# EAGLE design LCD-Shield V2 (EAGLE 9.5.2)
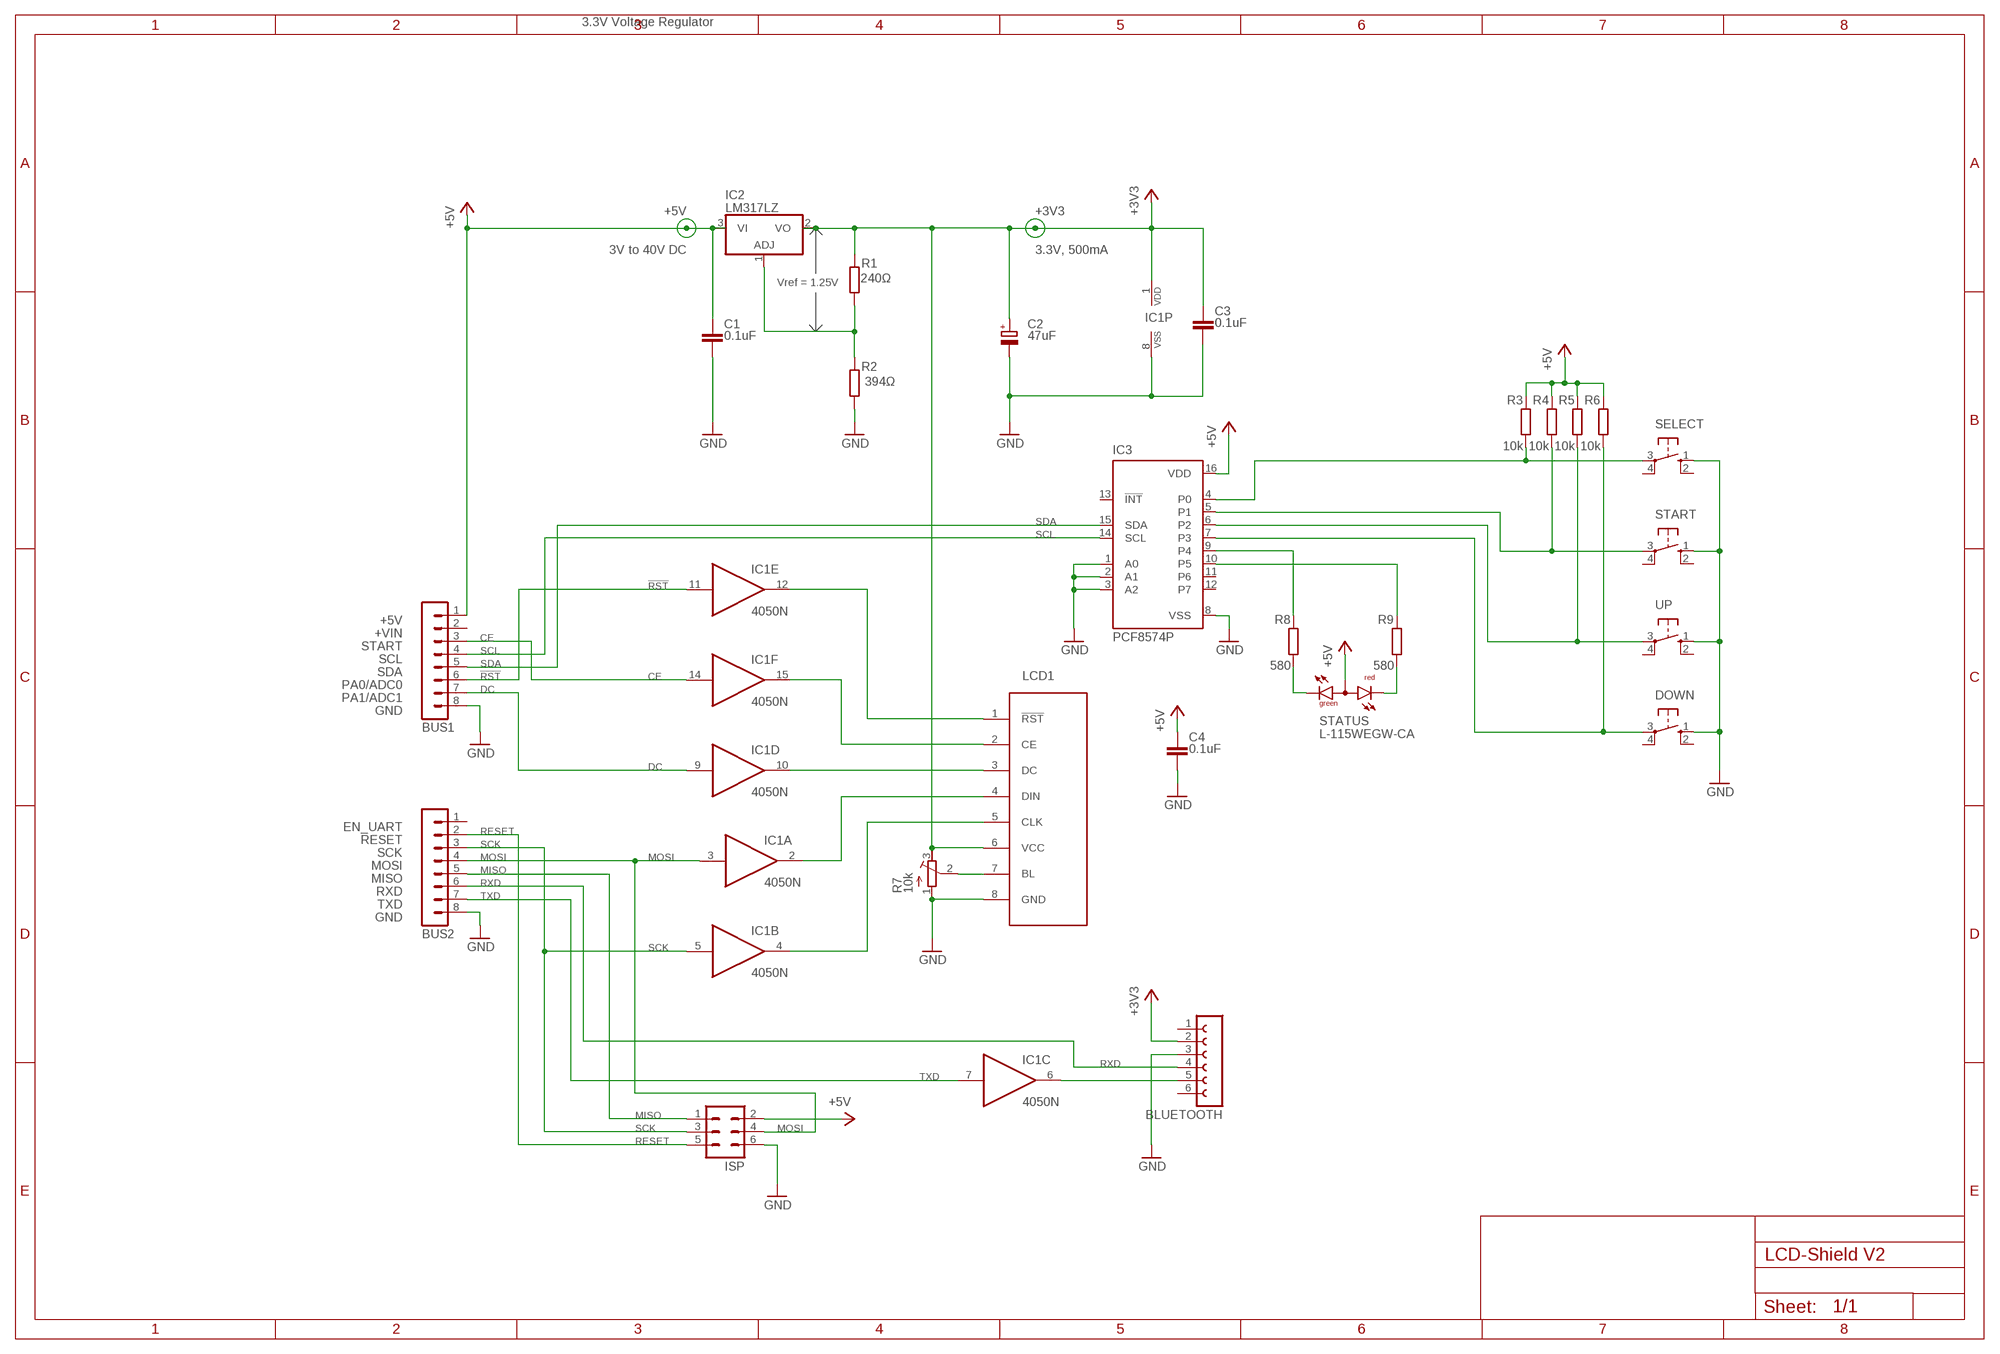
[diagram p0: schematic, sheet 1]

## Parts
BLUETOOTH  FE06-1  [FE06]
BUS1  MA08-1  [MA08-1]
BUS2  MA08-1  [MA08-1]
C1  0.1uF  C-EU025-024X044  [C025-024X044]
C2  47uF  CPOL-EUE2-4  [E2-4]
C3  0.1uF  C-EU025-024X044  [C025-024X044]
C4  0.1uF  C-EU025-024X044  [C025-024X044]
DOWN  10-XX  [B3F-10XX]
IC1  4050N  [DIL16]
IC2  LM317LZ  [TO92]
IC3  PCF8574P  [DIL16]
ISP  MA03-2  [MA03-2]
LCD1  5110_LCD_NOKIA  [LCD_5110]
R1  240Ω  R-EU_0207/7  [0207/7]
R2  394Ω  R-EU_0207/7  [0207/7]
R3  10k  R-EU_0207/7  [0207/7]
R4  10k  R-EU_0207/7  [0207/7]
R5  10k  R-EU_0207/7  [0207/7]
R6  10k  R-EU_0207/7  [0207/7]
R7  10k  R-TRIMM3296W  [RTRIM3296W]
R8  580  R-EU_0207/7  [0207/7]
R9  580  R-EU_0207/7  [0207/7]
SELECT  10-XX  [B3F-10XX]
START  10-XX  [B3F-10XX]
STATUS  L-115WEGW-CA  [DUOLED-A-3MM]
UP  10-XX  [B3F-10XX]

## Nets
!RST: BUS1.6 IC1.11(E:I)
+3V3: BLUETOOTH.2 C2.+ C3.1 IC1.1(P:VDD) IC2.2(VO) LCD1.6(VCC) R1.2 R7.3(E)
+5V: BUS1.1 C1.1 C4.1 IC2.3(VI) IC3.16(VDD) ISP.2 R3.2 R4.2 R5.2 R6.2 STATUS.2(A)
CE: BUS1.3 IC1.14(F:I)
DC: BUS1.7 IC1.9(D:I)
GND: BLUETOOTH.3 BUS1.8 BUS2.8 C1.2 C2.- C3.2 C4.2 DOWN.1(S) IC1.8(P:VSS) IC3.1(A0) IC3.2(A1) IC3.3(A2) IC3.8(VSS) ISP.6 LCD1.8(GND) R2.1 R7.1(A) SELECT.1(S) START.1(S) UP.1(S)
MISO: BUS2.5 ISP.1
MOSI: BUS2.4 IC1.3(A:I) ISP.4
N$1: IC1.12(E:O) LCD1.1(!RST)
N$2: IC1.15(F:O) LCD1.2(CE)
N$3: IC1.10(D:O) LCD1.3(DC)
N$4: IC1.2(A:O) LCD1.4(DIN)
N$5: IC1.4(B:O) LCD1.5(CLK)
N$6: IC2.1(ADJ) R1.1 R2.2
N$7: R8.1 STATUS.1(CG)
N$8: LCD1.7(BL) R7.2(S)
N$9: R9.1 STATUS.3(CR)
N$10: IC3.9(P4) R8.2
N$11: IC3.10(P5) R9.2
N$17: IC3.4(P0) R3.1 SELECT.3(P)
N$18: IC3.5(P1) R4.1 START.3(P)
N$19: IC3.6(P2) R5.1 UP.3(P)
N$20: DOWN.3(P) IC3.7(P3) R6.1
N$22: BLUETOOTH.5 IC1.6(C:O)
RESET: BUS2.2 ISP.5
RXD: BLUETOOTH.4 BUS2.6
SCK: BUS2.3 IC1.5(B:I) ISP.3
SCL: BUS1.4 IC3.14(SCL)
SDA: BUS1.5 IC3.15(SDA)
TXD: BUS2.7 IC1.7(C:I)
Unconnected: BLUETOOTH.1 BLUETOOTH.6 BUS1.2 BUS2.1 DOWN.2(S1) DOWN.4(P1) IC3.11(P6) IC3.12(P7) IC3.13(!INT) SELECT.2(S1) SELECT.4(P1) START.2(S1) START.4(P1) UP.2(S1) UP.4(P1)

## Notes on the sheet
- 3.3V Voltage Regulator
- 3V to 40V DC | 3.3V, 500mA
- Vref = 1.25V
- +5V
- +VIN
- START
- SCL
- SDA
- PA0/ADC0
- PA1/ADC1
- GND
- EN_UART
- RESET
- SCK
- MOSI
- MISO
- RXD
- TXD
- GND

## Library data of the parts
BLUETOOTH = con-lsta:FE06-1: FEMALE HEADER; OC_FARNELL: unknown; OC_NEWARK: unknown
BUS1 BUS2 = con-lstb:MA08-1: PIN HEADER; OC_FARNELL: unknown; OC_NEWARK: unknown
C1 C3 C4 = rcl:C-EU: CAPACITOR, European symbol
C2 = rcl:CPOL-EU: POLARIZED CAPACITOR, European symbol
DOWN SELECT START UP = switch-omron:10-XX: OMRON SWITCH; MPN: B3F-1000; OC_FARNELL: 176432; OC_NEWARK: 36M3542
IC1 = 40xx:4050: Hex non-inverting BUFFER
IC2 = linear:*317: Positive VOLTAGE REGULATOR
IC3 = micro-philips:PCF8574: I2C-Bus Remote 8-bit I/O expander http://www.semiconductors.philips.com/acrobat_download/datasheets/PCF8574_4.pdf; MPN: PCF8574PN; OC_FARNELL: 204020; OC_NEWARK: 11N8515
ISP = con-lstb:MA03-2: PIN HEADER; OC_FARNELL: unknown; OC_NEWARK: unknown
LCD1 = 5110_LCD:5110_LCD_NOKIA
R1-R6 R8 R9 = rcl:R-EU_: RESISTOR, European symbol
R7 = rcl:R-TRIMM: Trimm resistor; SPICEMODEL: X; SPICEPREFIXL: POT
STATUS = led:L-115WEGW-CA: T-1(3mm) BI-COLOR INDICATOR LAMP Source: Kingbright .. 2_colour_led_.pdf

## Board
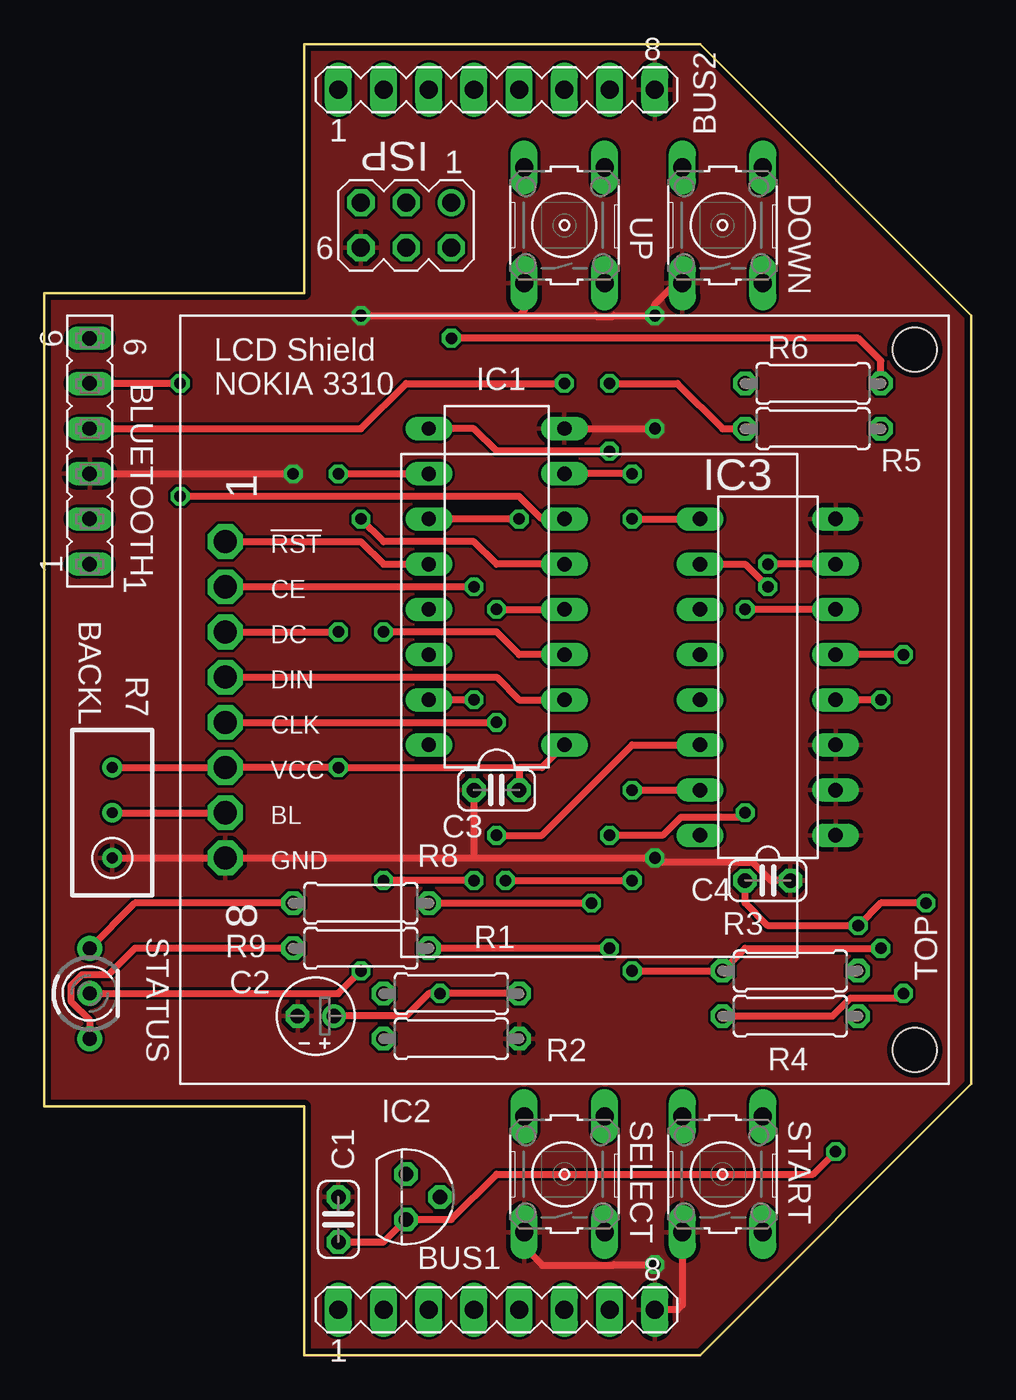
[diagram p1: board, top side]
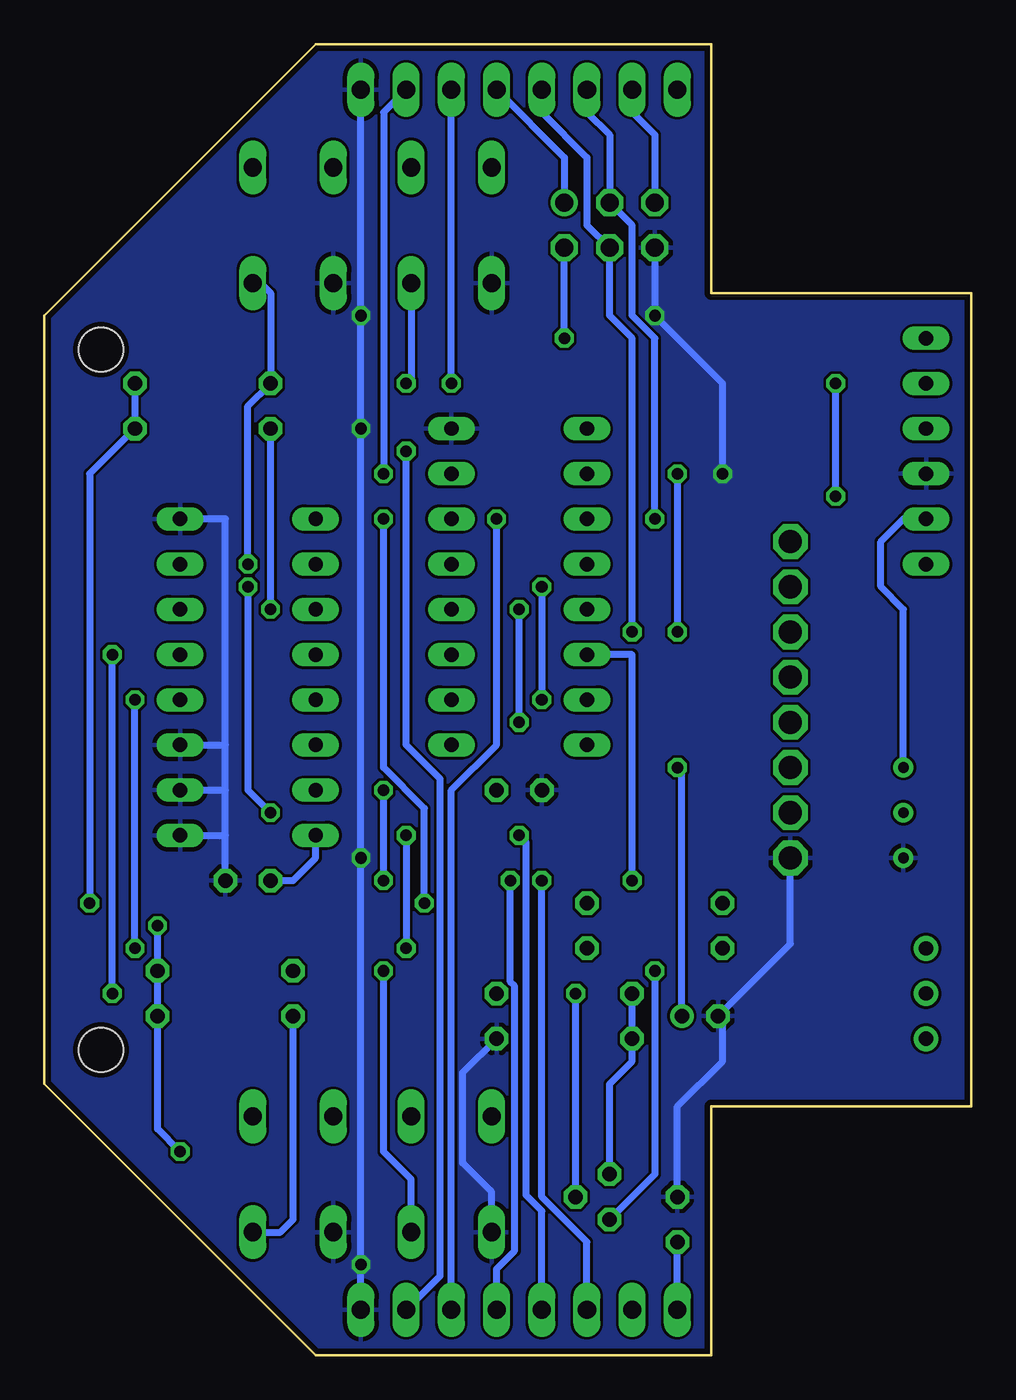
[diagram p2: board, bottom side, seen from below]

Size 52.07 x 73.66 mm. Coordinates in mm from the lower left corner, seen from the top.
Outline: 36.83,73.66 36.83,73.66
Outline: 36.83,73.66 14.61,73.66 14.61,59.69 0,59.69 0,13.97 14.61,13.97 14.61,0 36.83,0 52.07,15.24 52.07,58.42 36.83,73.66
Copper layers (1*16): Top 0.035mm / dielectric 1.5mm / Bottom 0.035mm
Design rules "default *": minimum track width 6mil, minimum drill 0.35mm, track to track 6mil, track to pad 6mil, pad to pad 6mil, via to via 6mil, smd to smd 6mil, copper to edge 0.3mm, drill to drill 6mil, minimum pad ring 10mil, minimum via ring 8mil, stop-mask expansion 4mil, vias tented up to drill 0mil, thermal gap 10mil

### Footprints (pad centres in the part's own frame; a part is rotated, then mirrored left to right if it is on the bottom)
FE06 = drill 0.813 long: 1 -6.35,0; 2 -3.81,0; 3 -1.27,0; 4 1.27,0; 5 3.81,0; 6 6.35,0
MA08-1 = drill 1.016 long: 1 -8.89,0; 2 -6.35,0; 3 -3.81,0; 4 -1.27,0; 5 1.27,0; 6 3.81,0; 7 6.35,0; 8 8.89,0
C025-024X044 = drill 0.813 octagon: 1 -1.27,0; 2 1.27,0
E2-4 = drill 0.813 pad 1.27: + -1.016,0 | drill 0.813 pad 1.27 octagon: - 1.016,0
B3F-10XX = drill 1.016 long: 1 -3.251,2.261; 2 3.251,2.261; 3 -3.251,-2.261; 4 3.251,-2.261
DIL16 = drill 0.813 long: 1 -8.89,-3.81; 2 -6.35,-3.81; 3 -3.81,-3.81; 4 -1.27,-3.81; 5 1.27,-3.81; 6 3.81,-3.81; 7 6.35,-3.81; 8 8.89,-3.81; 9 8.89,3.81; 10 6.35,3.81; 11 3.81,3.81; 12 1.27,3.81; 13 -1.27,3.81; 14 -3.81,3.81; 15 -6.35,3.81; 16 -8.89,3.81
TO92 = drill 0.813 octagon: 1 -1.27,0; 2 0,1.905; 3 1.27,0
MA03-2 = drill 1.016: 1 -2.54,-1.27 | drill 1.016 octagon: 2 -2.54,1.27; 3 0,-1.27; 4 0,1.27; 5 2.54,-1.27; 6 2.54,1.27
LCD_5110 = drill 1.3 octagon: 1 12.7,2.54; 2 15.24,2.54; 3 17.78,2.54; 4 20.32,2.54; 5 22.86,2.54; 6 25.4,2.54; 7 27.94,2.54; 8 30.48,2.54 | hole 2.5: 1.905,41.275; 41.275,41.275
0207/7 = drill 0.813 octagon: 1 -3.81,0; 2 3.81,0
RTRIM3296W = drill 0.61: 1 0,-2.54; 2 0,0; 3 0,2.54
DUOLED-A-3MM = drill 0.8 pad 1.4: 1 -2.54,0; 2 0,0; 3 2.54,0

### Placement (x,y rotation side)
BLUETOOTH  2.54,50.8 90 top
BUS1  25.4,2.54 0 top
BUS2  25.4,71.12 0 top
C1  16.51,7.62 90 top
C2  15.24,19.05 180 top
C3  25.4,31.75 180 top
C4  40.64,26.67 0 top
DOWN  38.1,63.5 90 top
IC1  25.4,43.18 90 top
IC2  20.32,8.89 270 top
IC3  40.64,38.1 90 top
ISP  20.32,63.5 180 top
LCD1  7.62,58.42 270 top
R1  22.86,20.32 0 top
R2  22.86,17.78 180 top
R3  41.91,21.59 0 top
R4  41.91,19.05 0 top
R5  43.18,52.07 0 top
R6  43.18,54.61 0 top
R7  3.81,30.48 0 top
R8  17.78,25.4 0 top
R9  17.78,22.86 0 top
SELECT  29.21,10.16 90 top
START  38.1,10.16 90 top
STATUS  2.54,20.32 270 top
UP  29.21,63.5 90 top

### Tracks (layer width: path | path; a pad name or v marks a point on that pad's centre or on a via)
!RST  (via drill 0.65)
  Top 0.406: v26.67,46.99 IC1.11
  Bottom 0.406: BUS1.6 29.21,31.75 26.67,34.29 v26.67,46.99
+3V3  (via drill 0.65)
  Top 0.406: R1.2 v22.23,20.32 21.59,20.32 20.32,19.05 C2.+ | 26.67,33.02 v16.51,33.02 LCD1.6 R7.3 | 26.67,33.02 C3.1 | IC1.1 27.94,33.02 26.67,33.02
  Bottom 0.406: C2.+ 16.26,32.77 v16.51,33.02 | IC2.2 v22.23,20.32 | R7.3 3.81,41.91 5.08,43.18 5.08,45.72 3.81,46.99 BLUETOOTH.2
+5V  (via drill 0.65)
  Top 0.406: C1.1 19.05,6.35 IC2.3 22.86,7.62 25.4,10.16 43.18,10.16 v44.45,11.43 | C4.1 39.37,25.4 40.64,24.13 v45.72,24.13 46.99,25.4 v49.53,25.4 | R6.2 46.99,55.88 45.72,57.15 v22.86,57.15 | STATUS.2 16.51,20.32 v17.78,21.59
  Bottom 0.406: BUS1.1 C1.1 | v44.45,11.43 45.72,12.7 R4.2 R3.2 v45.72,24.13 | C4.1 38.1,26.67 36.83,27.94 IC3.16 | R6.2 R5.2 49.53,49.53 v49.53,25.4 | v22.86,57.15 ISP.2 | v17.78,21.59 17.78,10.16 IC2.3
CE  (via drill 0.65)
  Top 0.406: v24.13,26.67 v19.05,26.67
  Bottom 0.406: BUS1.3 21.59,6.35 24.13,8.89 v24.13,26.67 | v19.05,26.67 19.05,39.37 IC1.14
DC  (via drill 0.65)
  Top 0.406: v31.75,50.8 25.4,50.8 24.13,52.07 IC1.9
  Bottom 0.406: BUS1.7 29.84,4.45 29.84,32.38 31.75,34.29 v31.75,50.8
GND  (via drill 0.65)
  Top 0.406: R7.1 LCD1.8 24.13,27.94 | 24.13,27.94 v34.29,27.94 34.54,27.69 39.79,27.69 40.81,26.67 C4.2 | C3.2 24.13,27.94 | IC1.8 v34.29,52.07 | v17.78,58.42 26.67,58.42 | 26.67,58.42 30.96,58.42 31.01,58.37 31.93,58.37 31.98,58.42 v34.29,58.42 34.29,59.05 35.56,60.33 35.76,60.33 DOWN.1 | UP.1 26.95,58.7 26.67,58.42 | BLUETOOTH.3 v13.97,49.53 | SELECT.1 26.95,6.07 27.99,5.03 31.93,5.03 31.98,5.08 v34.29,5.08 | START.1 35.84,2.82 35.56,2.54 BUS1.8
  Bottom 0.406: C1.2 16.51,13.97 13.97,16.51 13.97,18.8 C2.- 10.16,23.11 LCD1.8 | BUS1.8 v34.29,5.08 v34.29,27.94 v34.29,52.07 v34.29,58.42 BUS2.8 | C4.2 41.91,29.21 | 41.91,29.21 41.91,31.75 | 41.91,31.75 41.91,34.29 | 41.91,34.29 41.91,46.99 IC3.8 | IC3.1 41.91,29.21 | ISP.6 v17.78,58.42 13.97,54.61 v13.97,49.53 | IC3.3 41.91,34.29 | IC3.2 41.91,31.75 | R2.1 28.57,15.88 28.57,10.79 26.95,9.17 SELECT.1
  pour Bottom: -1.27,60.96 13.97,60.96 13.97,74.93 36.83,74.93 53.34,58.42 53.34,15.24 36.83,-1.27 13.97,-1.27 13.97,12.7 -1.27,12.7
  pour Top: -1.27,60.96 13.97,60.96 13.97,74.93 36.83,74.93 53.34,58.42 53.34,15.24 36.83,-1.27 13.97,-1.27 13.97,12.7 -1.27,12.7
MISO
  Bottom 0.406: BUS2.5 22.86,67.31 ISP.1
MOSI  (via drill 0.65)
  Top 0.406: IC1.3 26.67,39.37 25.4,40.64 v19.05,40.64
  Bottom 0.406: BUS2.4 24.13,69.85 21.59,67.31 21.59,63.5 ISP.4 20.32,58.42 19.05,57.15 v19.05,40.64
N$1
  Top 0.406: LCD1.1 17.78,45.72 19.05,44.45 IC1.12
N$2  (via drill 0.65)
  Top 0.406: LCD1.2 v24.13,43.18 | v24.13,36.83 IC1.15
  Bottom 0.406: v24.13,43.18 v24.13,36.83
N$3  (via drill 0.65)
  Top 0.406: LCD1.3 v16.51,40.64 | v16.51,49.53 IC1.10
  Bottom 0.406: v16.51,49.53 v16.51,40.64
N$4
  Top 0.406: LCD1.4 25.4,38.1 26.67,36.83 IC1.2
N$5  (via drill 0.65)
  Top 0.406: LCD1.5 v25.4,35.56 | v25.4,41.91 IC1.4
  Bottom 0.406: v25.4,35.56 v25.4,41.91
N$6
  Bottom 0.406: IC2.1 20.32,15.24 19.05,16.51 R2.2 R1.1
N$7
  Top 0.406: R8.1 5.08,25.4 STATUS.1
N$8
  Top 0.406: R7.2 LCD1.7
N$9
  Top 0.406: STATUS.3 2.54,18.83 1.48,19.88 1.48,20.76 2.1,21.38 3.6,21.38 5.08,22.86 R9.1
N$10  (via drill 0.65)
  Top 0.406: R8.2 v30.73,25.4 | v33.02,46.99 IC3.9
  Bottom 0.406: v30.73,25.4 30.73,30.73 33.02,33.02 v33.02,46.99
N$11  (via drill 0.65)
  Top 0.406: IC3.10 39.37,44.45 v40.64,43.18 | v39.37,30.48 39.12,30.23 35.75,30.23 34.73,29.21 v31.75,29.21 | v31.75,22.86 R9.2
  Bottom 0.406: v40.64,43.18 40.64,31.75 v39.37,30.48 | v31.75,29.21 v31.75,22.86
N$17  (via drill 0.65)
  Top 0.406: v33.02,21.59 R3.1 39.37,22.86 v46.99,22.86 | v46.99,36.83 IC3.4
  Bottom 0.406: SELECT.3 31.47,9.88 33.02,11.43 v33.02,21.59 | v46.99,22.86 v46.99,36.83
N$18  (via drill 0.65)
  Top 0.406: R4.1 44.28,19.05 45.3,20.07 48.01,20.07 v48.26,20.32 | v48.26,39.37 IC3.5
  Bottom 0.406: START.3 38.81,6.91 38.1,7.62 R4.1 | v48.26,20.32 v48.26,39.37
N$19  (via drill 0.65)
  Top 0.406: IC3.6 v39.37,41.91 | v31.75,54.61 35.56,54.61 38.1,52.07 R5.1
  Bottom 0.406: v39.37,41.91 R5.1 | UP.3 31.47,54.89 v31.75,54.61
N$20  (via drill 0.65)
  Top 0.406: IC3.7 v40.64,44.45
  Bottom 0.406: v40.64,44.45 40.64,53.34 R6.1 39.37,59.69 39.93,60.25 DOWN.3
N$22  (via drill 0.65)
  Top 0.406: IC1.6 27.94,46.99 26.67,48.26 v7.62,48.26 | v7.62,54.61 BLUETOOTH.5
  Bottom 0.406: v7.62,48.26 v7.62,54.61
RESET
  Bottom 0.406: BUS2.2 19.05,69.85 17.78,68.58 ISP.5
RXD  (via drill 0.65)
  Top 0.406: BLUETOOTH.4 17.78,52.07 20.32,54.61 v29.21,54.61
  Bottom 0.406: v29.21,54.61 BUS2.6
SCK  (via drill 0.65)
  Top 0.406: IC1.5 25.4,44.45 24.13,45.72 19.05,45.72 v17.78,46.99
  Bottom 0.406: BUS2.3 21.59,69.85 20.32,68.58 ISP.3 19.05,63.5 19.05,58.42 17.78,57.15 v17.78,46.99
SCL  (via drill 0.65)
  Top 0.406: v25.4,29.21 27.94,29.21 33.02,34.29 IC3.14
  Bottom 0.406: BUS1.4 24.13,8.1 25.01,8.98 25.01,28.82 v25.4,29.21
SDA  (via drill 0.65)
  Top 0.406: v25.9,26.67 v33.02,26.67 | v33.02,31.75 IC3.15
  Bottom 0.406: BUS1.5 26.67,4.85 25.65,5.86 25.65,20.74 25.9,20.98 v25.9,26.67 | v33.02,26.67 v33.02,31.75
TXD  (via drill 0.65)
  Top 0.406: v33.02,49.53 IC1.7
  Bottom 0.406: BUS2.7 33.02,69.85 v33.02,49.53

### Text on the board
tNames: 6 | LCD Shield / NOKIA 3310 | 1 | BACKL.